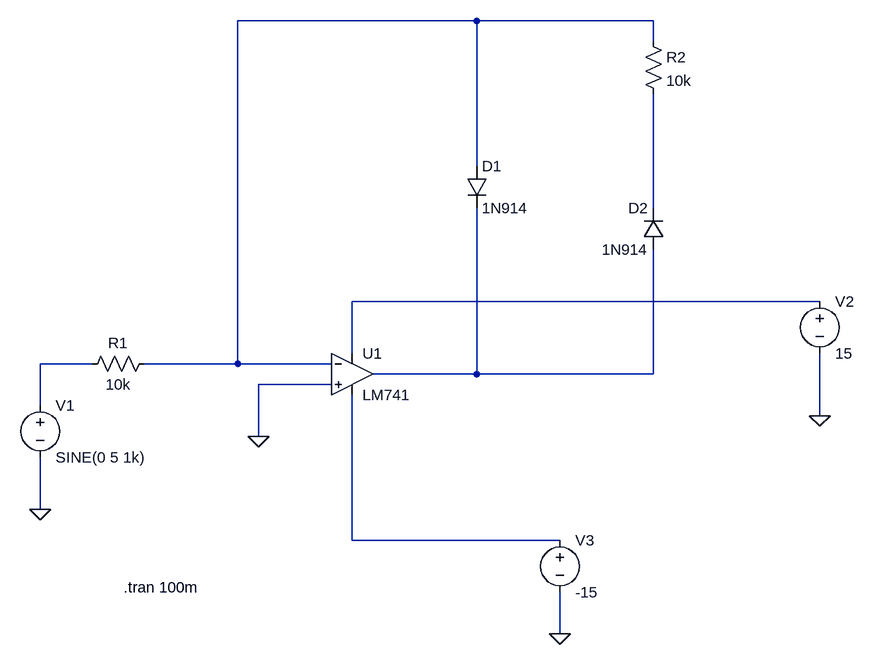
[diagram p0: schematic Hassas_yarım_dalga_LM741.asc]
Hassas_yarım_dalga_LM741.asc, the LTspice schematic file:
Version 4
SHEET 1 1080 680
WIRE 496 -384 128 -384
WIRE 768 -384 496 -384
WIRE 768 -352 768 -384
WIRE 496 -160 496 -384
WIRE 768 -96 768 -272
WIRE 1024 48 304 48
WIRE 304 128 304 48
WIRE -96 144 -176 144
WIRE 128 144 128 -384
WIRE 128 144 -16 144
WIRE 272 144 128 144
WIRE 496 160 496 -96
WIRE 496 160 336 160
WIRE 768 160 768 -32
WIRE 768 160 496 160
WIRE 272 176 160 176
WIRE -176 208 -176 144
WIRE 1024 224 1024 128
WIRE 160 256 160 176
WIRE -176 368 -176 288
WIRE 304 416 304 192
WIRE 624 416 304 416
WIRE 624 560 624 496
FLAG 160 256 0
FLAG -176 368 0
FLAG 1024 224 0
FLAG 624 560 0
SYMBOL OpAmps\\LM741 304 96 R0
SYMATTR InstName U1
SYMBOL res 0 128 R90
WINDOW 0 0 56 VBottom 2
WINDOW 3 32 56 VTop 2
SYMATTR InstName R1
SYMATTR Value 10k
SYMBOL res 752 -368 R0
SYMATTR InstName R2
SYMATTR Value 10k
SYMBOL diode 480 -160 R0
SYMATTR InstName D1
SYMATTR Value 1N914
SYMBOL diode 784 -32 R180
WINDOW 0 24 64 Left 2
WINDOW 3 24 0 Left 2
SYMATTR InstName D2
SYMATTR Value 1N914
SYMBOL voltage -176 192 R0
WINDOW 123 0 0 Left 0
WINDOW 39 0 0 Left 0
SYMATTR InstName V1
SYMATTR Value SINE(0 5 1k)
SYMBOL voltage 1024 32 R0
WINDOW 123 0 0 Left 0
WINDOW 39 0 0 Left 0
SYMATTR InstName V2
SYMATTR Value 15
SYMBOL voltage 624 400 R0
WINDOW 123 0 0 Left 0
WINDOW 39 0 0 Left 0
SYMATTR InstName V3
SYMATTR Value -15
TEXT -48 488 Left 2 !.tran 100m

The netlist it stands for:
* Hassas_yarım_dalga_LM741.asc
XU1 0 N001 N003 N006 N005 LM741  ; pins In+ In- V+ V- OUT
R1 N001 N004 10k
R2 N001 N002 10k
D1 N001 N005 1N914
D2 N005 N002 1N914
V1 N004 0 SINE(0 5 1k)
V2 N003 0 15
V3 N006 0 -15
.model D D
.lib standard.dio
.tran 100m
.lib LM741.lib
.backanno
.end